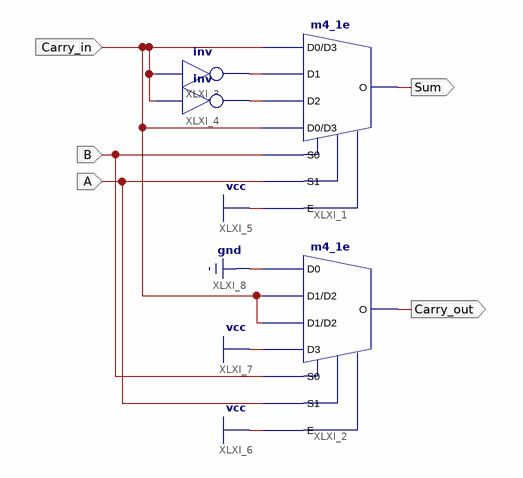
[diagram p0: schematic sheet 1]
// Xilinx ISE schematic FA_MUX41.sch (spartan3e) as structural Verilog: 4 symbols, 5 ports
module FA_MUX41 (
  input  Carry_in,
  input  A,
  input  B,
  output Sum,
  output Carry_out
);

  wire XLXN_3, XLXN_4;

  m4_1e XLXI_1 (.D0(Carry_in), .D1(XLXN_3), .D2(XLXN_4), .D3(Carry_in), .E(1'b1), .S0(B), .S1(A), .O(Sum));
  m4_1e XLXI_2 (.D0(1'b0), .D1(Carry_in), .D2(Carry_in), .D3(1'b1), .E(1'b1), .S0(B), .S1(A), .O(Carry_out));
  not XLXI_3 (XLXN_3, Carry_in);
  not XLXI_4 (XLXN_4, Carry_in);
endmodule
